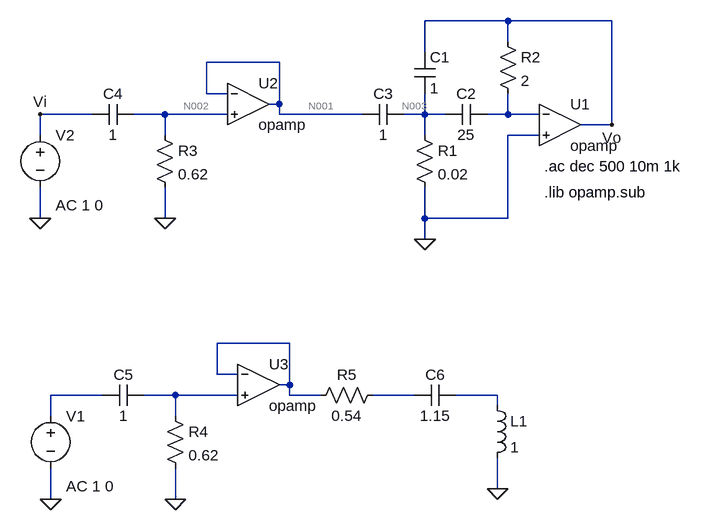
[diagram p0: schematic punto5.asc]
punto5.asc, the LTspice schematic file:
Version 4.1
SHEET 1 880 708
WIRE 224 -48 96 -48
WIRE 384 -48 224 -48
WIRE 224 -16 224 -48
WIRE 96 0 96 -48
WIRE -128 16 -240 16
WIRE -240 64 -240 16
WIRE -208 64 -240 64
WIRE -128 80 -128 16
WIRE -128 80 -144 80
WIRE -416 96 -496 96
WIRE -304 96 -352 96
WIRE -208 96 -304 96
WIRE -128 96 -128 80
WIRE 0 96 -128 96
WIRE 96 96 96 64
WIRE 96 96 64 96
WIRE 128 96 96 96
WIRE 224 96 224 64
WIRE 224 96 192 96
WIRE 272 96 224 96
WIRE 384 112 384 -48
WIRE 384 112 336 112
WIRE -496 128 -496 96
WIRE -304 128 -304 96
WIRE 96 128 96 96
WIRE 272 128 224 128
WIRE -496 256 -496 208
WIRE -304 256 -304 208
WIRE 96 256 96 208
WIRE 224 256 224 128
WIRE 224 256 96 256
WIRE 96 288 96 256
WIRE -112 448 -224 448
WIRE -224 496 -224 448
WIRE -192 496 -224 496
WIRE -112 512 -112 448
WIRE -112 512 -128 512
WIRE -400 528 -480 528
WIRE -288 528 -336 528
WIRE -192 528 -288 528
WIRE -112 528 -112 512
WIRE -64 528 -112 528
WIRE 80 528 16 528
WIRE 208 528 144 528
WIRE 208 544 208 528
WIRE -480 560 -480 528
WIRE -288 560 -288 528
WIRE 208 672 208 624
WIRE -480 688 -480 640
WIRE -288 688 -288 640
FLAG 96 288 0
FLAG 384 112 Vo
FLAG -304 256 0
FLAG -496 96 Vi
FLAG -496 256 0
FLAG -288 688 0
FLAG -480 688 0
FLAG 208 672 0
SYMBOL cap 80 0 R0
SYMATTR InstName C1
SYMATTR Value 1
SYMBOL cap 192 80 R90
WINDOW 0 0 32 VBottom 2
WINDOW 3 32 32 VTop 2
SYMATTR InstName C2
SYMATTR Value 25
SYMBOL cap 64 80 R90
WINDOW 0 0 32 VBottom 2
WINDOW 3 32 32 VTop 2
SYMATTR InstName C3
SYMATTR Value 1
SYMBOL res 80 112 R0
SYMATTR InstName R1
SYMATTR Value 0.02
SYMBOL res 208 -32 R0
SYMATTR InstName R2
SYMATTR Value 2
SYMBOL OpAmps\\opamp 304 48 R0
SYMATTR InstName U1
SYMBOL cap -352 80 R90
WINDOW 0 0 32 VBottom 2
WINDOW 3 32 32 VTop 2
SYMATTR InstName C4
SYMATTR Value 1
SYMBOL res -320 112 R0
SYMATTR InstName R3
SYMATTR Value 0.62
SYMBOL voltage -496 112 R0
WINDOW 123 24 124 Left 2
WINDOW 39 0 0 Left 0
SYMATTR InstName V2
SYMATTR Value ""
SYMATTR Value2 AC 1 0
SYMBOL OpAmps\\opamp -176 16 R0
SYMATTR InstName U2
SYMBOL cap -336 512 R90
WINDOW 0 0 32 VBottom 2
WINDOW 3 32 32 VTop 2
SYMATTR InstName C5
SYMATTR Value 1
SYMBOL res -304 544 R0
SYMATTR InstName R4
SYMATTR Value 0.62
SYMBOL voltage -480 544 R0
WINDOW 123 24 124 Left 2
WINDOW 39 0 0 Left 0
SYMATTR InstName V1
SYMATTR Value ""
SYMATTR Value2 AC 1 0
SYMBOL OpAmps\\opamp -160 448 R0
SYMATTR InstName U3
SYMBOL res 32 512 R90
WINDOW 0 0 56 VBottom 2
WINDOW 3 32 56 VTop 2
SYMATTR InstName R5
SYMATTR Value 0.54
SYMBOL cap 144 512 R90
WINDOW 0 0 32 VBottom 2
WINDOW 3 32 32 VTop 2
SYMATTR InstName C6
SYMATTR Value 1.15
SYMBOL ind 192 528 R0
SYMATTR InstName L1
SYMATTR Value 1
SYMATTR SpiceLine Rser=1m
TEXT 280 176 Left 2 !.ac dec 500 10m 1k
TEXT 280 216 Left 2 !.lib opamp.sub

The netlist it stands for:
* punto5.asc
C1 Vo N003 1
C2 N004 N003 25
C3 N003 N001 1
R1 N003 0 0.02
R2 Vo N004 2
X§U1 N004 0 Vo opamp Aol=100K GBW=10Meg  ; pins invin noninvin out
C4 N002 Vi 1
R3 N002 0 0.62
V2 Vi 0 AC 1 0
X§U2 N001 N002 N001 opamp Aol=100K GBW=10Meg  ; pins invin noninvin out
C5 N007 N006 1
R4 N007 0 0.62
V1 N006 0 AC 1 0
X§U3 N005 N007 N005 opamp Aol=100K GBW=10Meg  ; pins invin noninvin out
R5 N008 N005 0.54
C6 N009 N008 1.15
L1 N009 0 1 Rser=1m
.ac dec 500 10m 1k
.lib opamp.sub
.backanno
.end

* Results of the author's LTspice run, read from the files saved beside the schematic
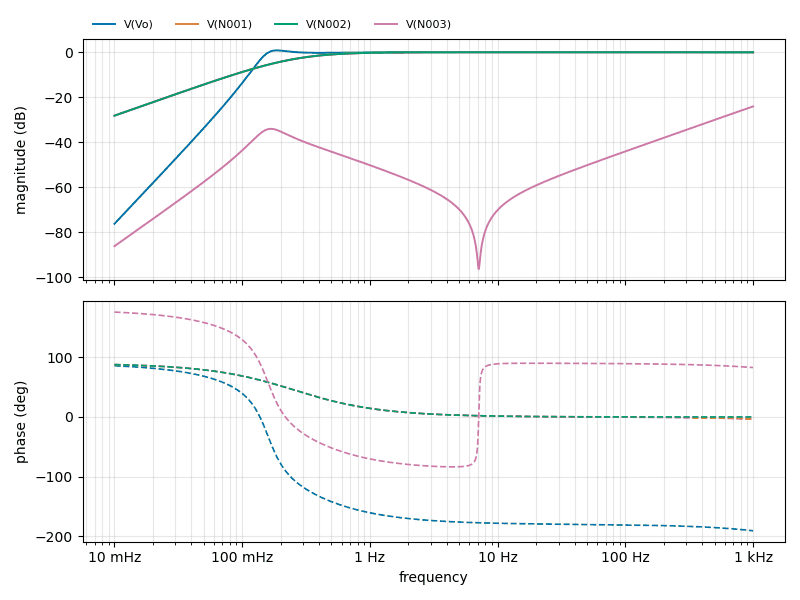
[diagram p1: AC Analysis of punto5.asc, plotted from the saved traces]
* AC Analysis, 1 run:
*   V(Vo): -76.24 dB at 10 mHz, -0.06 dB at 1 kHz, peak 0.80 dB at 187.1 mHz, 3 dB below the peak at 144.5 mHz
*   V(N001): -28.20 dB at 10 mHz, -0.05 dB at 1 kHz, peak -0.00 dB at 48.53 Hz, 3 dB below the peak at 256.7 mHz
*   V(N002): -28.20 dB at 10 mHz, -0.00 dB at 1 kHz, peak -0.00 dB at 1 kHz, 3 dB below the peak at 256.7 mHz
*   V(N003): -86.18 dB at 10 mHz, -24.10 dB at 1 kHz, peak -24.10 dB at 1 kHz, 3 dB below the peak at 704.4 Hz